# Altium schematic sheet ATmega Motherboard.SchDoc
size A4
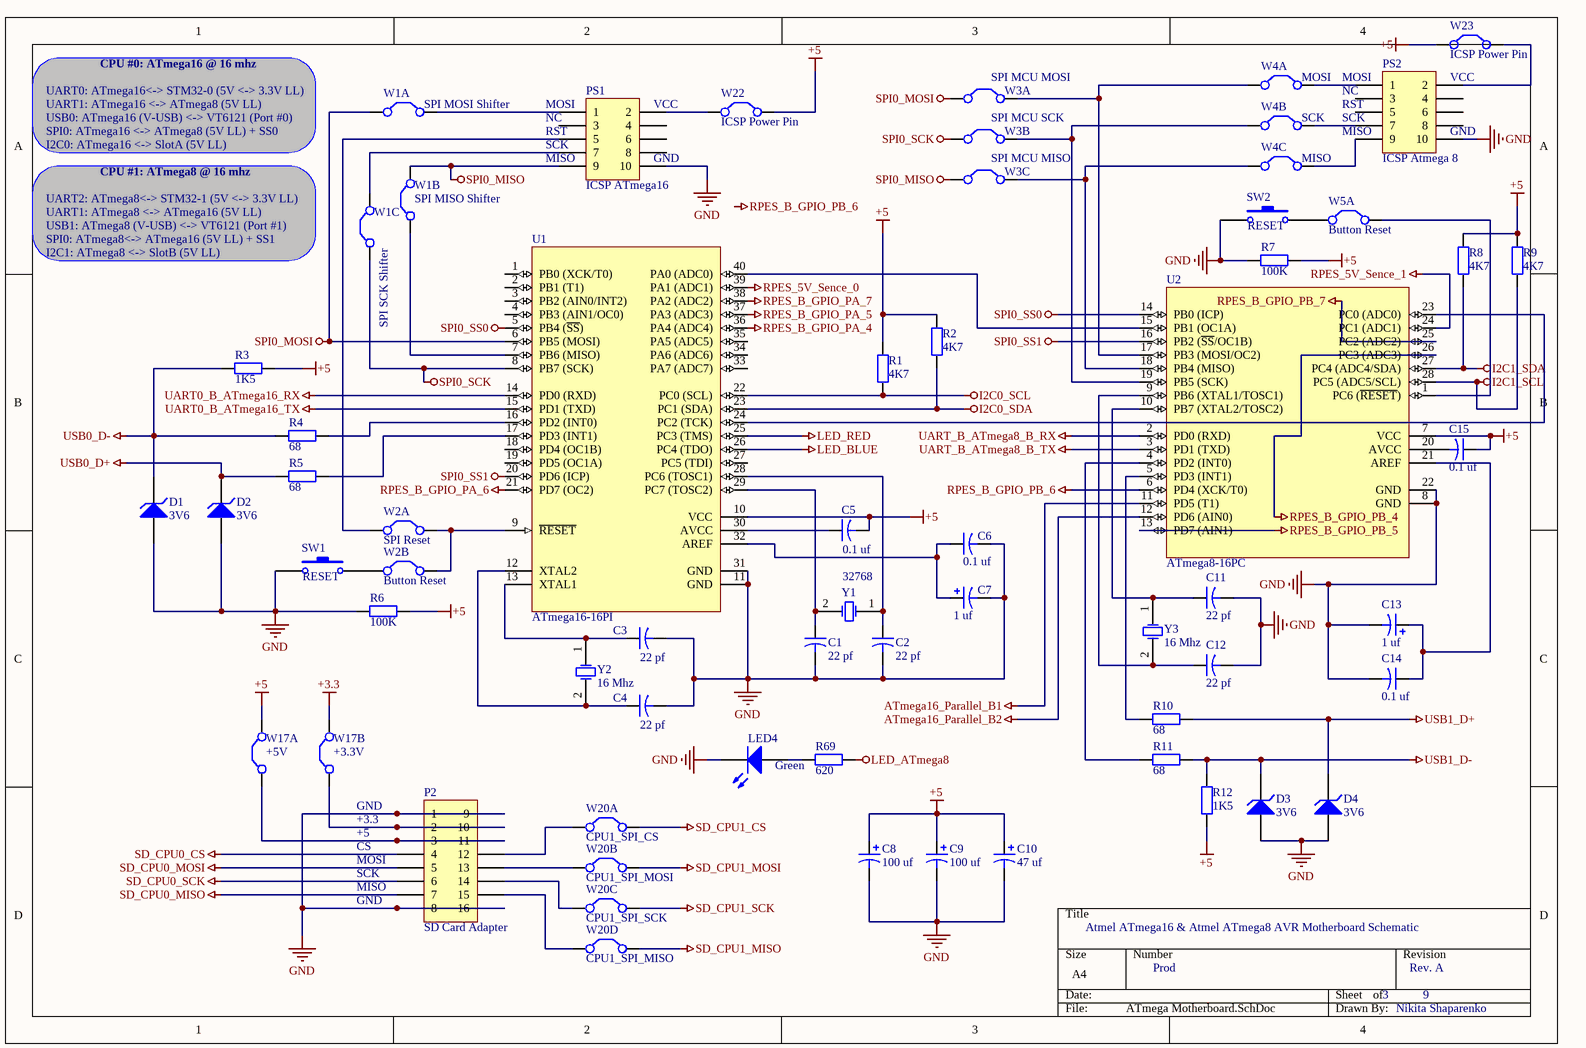
[diagram p0: ATmega Motherboard.SchDoc]

## Parts
C1  value 22 pf  [CAPR5-4X5]  (hidden comment: Cap2)
C2  value 22 pf  [CAPR5-4X5]  (hidden comment: Cap2)
C3  value 22 pf  [CAPR5-4X5]  (hidden comment: Cap2)
C4  value 22 pf  [CAPR5-4X5]  (hidden comment: Cap2)
C5  value 0.1 uf  [CAPR5-4X5]  (hidden comment: Cap2)
C6  value 0.1 uf  [CAPR5-4X5]  (hidden comment: Cap2)
C7  value 1 uf  [RAD-0.2]  (hidden comment: Cap Pol1)
C8  value 100 uf  [RAD-0.2]  (hidden comment: Cap Pol1)
C9  value 100 uf  [RAD-0.2]  (hidden comment: Cap Pol1)
C10  value 47 uf  [RAD-0.2]  (hidden comment: Cap Pol1)
C11  value 22 pf  [CAPR5-4X5]  (hidden comment: Cap2)
C12  value 22 pf  [CAPR5-4X5]  (hidden comment: Cap2)
C13  value 1 uf  [RAD-0.2]  (hidden comment: Cap Pol1)
C14  value 0.1 uf  [CAPR5-4X5]  (hidden comment: Cap2)
C15  value 0.1 uf  [CAPR5-4X5]  (hidden comment: Cap2)
D1  3V6  [DIODE-0.7]
D2  3V6  [DIODE-0.7]
D3  3V6  [DIODE-0.7]
D4  3V6  [DIODE-0.7]
LED4  Green  [LED-1]
P2  SD Card Adapter  [HDR2X8_CEN]
PS1  ICSP ATmega16  [HDR2X5]
PS2  ICSP Atmega 8  [HDR2X5]
R1  value 4K7  [AXIAL-0.4]  (hidden comment: Res2)
R2  value 4K7  [AXIAL-0.4]  (hidden comment: Res2)
R3  value 1K5  [AXIAL-0.4]  (hidden comment: Res2)
R4  value 68  [AXIAL-0.4]  (hidden comment: Res2)
R5  value 68  [AXIAL-0.4]  (hidden comment: Res2)
R6  value 100K  [AXIAL-0.4]  (hidden comment: Res2)
R7  value 100K  [AXIAL-0.4]  (hidden comment: Res2)
R8  value 4K7  [AXIAL-0.4]  (hidden comment: Res2)
R9  value 4K7  [AXIAL-0.4]  (hidden comment: Res2)
R10  value 68  [AXIAL-0.4]  (hidden comment: Res2)
R11  value 68  [AXIAL-0.4]  (hidden comment: Res2)
R12  value 1K5  [AXIAL-0.4]  (hidden comment: Res2)
R69  value 620  [AXIAL-0.4]  (hidden comment: Res2)
SW1  RESET  [SPST-2]
SW2  RESET  [SPST-2]
U1  ATmega16-16PI  [40P6]
U2  ATmega8-16PC  [28P3]
W1A  SPI MOSI Shifter  [RAD-0.1]
W1B  SPI MISO Shifter  [RAD-0.1]
W1C  SPI SCK Shifter  [RAD-0.1]
W2A  SPI Reset  [RAD-0.1]
W2B  Button Reset  [RAD-0.1]
W3A  SPI MCU MOSI  [RAD-0.1]
W3B  SPI MCU SCK  [RAD-0.1]
W3C  SPI MCU MISO  [RAD-0.1]
W4A  MOSI  [RAD-0.1]
W4B  SCK  [RAD-0.1]
W4C  MISO  [RAD-0.2]
W5A  Button Reset  [RAD-0.1]
W17A  +5V  [RAD-0.1]
W17B  +3.3V  [RAD-0.1]
W20A  CPU1_SPI_CS  [RAD-0.1]
W20B  CPU1_SPI_MOSI  [RAD-0.1]
W20C  CPU1_SPI_SCK  [RAD-0.1]
W20D  CPU1_SPI_MISO  [RAD-0.1]
W22  ICSP Power Pin  [RAD-0.1]
W23  ICSP Power Pin  [RAD-0.1]
Y1  32768  [R38]
Y2  16 Mhz  [R38]
Y3  16 Mhz  [R38]

## Nets
+3.3: W17B.2(C2)
+5: C5.2 C8.1 C9.1 C10.1 C15.1 R1.1 R2.1 R3.1 R6.1 R7.1 R8.1 R9.1 R12.2 U1.10(VCC) U2.7(VCC) W17A.2(C2) W22.2(C2) W23.1(C1)
ATmega16_Parallel_B1: U2.11(PD5_(T1))
ATmega16_Parallel_B2: U2.12(PD6_(AIN0))
GND: C1.2 C2.2 C3.2 C4.2 C6.2 C7.2 C8.2 C9.2 C10.2 C11.2 C12.2 C13.2 C14.2 D1.1(A) D2.1(A) D3.1(A) D4.1(A) LED4.2(K) P2.1 P2.8 P2.9 P2.16 PS1.10 PS2.10 R6.2 R7.2 SW1.1 SW2.1 U1.11(GND) U1.31(GND) U2.8(GND) U2.22(GND)
I2C0_SCL: R1.2 U1.22(PC0_(SCL))
I2C0_SDA: R2.2 U1.23(PC1_(SDA))
I2C1_SCL: R9.2 U2.28(PC5_(ADC5/SCL))
I2C1_SDA: R8.2 U2.27(PC4_(ADC4/SDA))
LED_ATmega8: R69.2
LED_BLUE: U1.26(PC4_(TDO))
LED_RED: U1.25(PC3_(TMS))
RPES_5V_Sence_0: U1.39(PA1_(ADC1))
RPES_5V_Sence_1: U2.24(PC1_(ADC1))
RPES_B_GPIO_PA_4: U1.36(PA4_(ADC4))
RPES_B_GPIO_PA_5: U1.37(PA3_(ADC3))
RPES_B_GPIO_PA_6: U1.21(PD7_(OC2))
RPES_B_GPIO_PA_7: U1.38(PA2_(ADC2))
RPES_B_GPIO_PB_4: U2.26(PC3_(ADC3))
RPES_B_GPIO_PB_5: U2.13(PD7_(AIN1))
RPES_B_GPIO_PB_6: U2.6(PD4_(XCK/T0))
RPES_B_GPIO_PB_7: U2.25(PC2_(ADC2))
SD_CPU0_CS: P2.4
SD_CPU0_MISO: P2.7
SD_CPU0_MOSI: P2.5
SD_CPU0_SCK: P2.6
SD_CPU1_CS: W20A.2(C2)
SD_CPU1_MISO: W20D.2(C2)
SD_CPU1_MOSI: W20B.2(C2)
SD_CPU1_SCK: W20C.2(C2)
SPI0_MISO: PS1.9 W1B.2(C2) W3C.1(C1)
SPI0_MOSI: U1.6(PB5_(MOSI)) W1A.1(C1) W3A.1(C1)
SPI0_SCK: U1.8(PB7_(SCK)) W1C.1(C1) W3B.1(C1)
SPI0_SS0: U1.5(PB4_(~{SS})) U2.14(PB0_(ICP))
SPI0_SS1: U1.20(PD6_(ICP)) U2.16(PB2_(~{SS}/OC1B))
UART0_B_ATmega16_RX: U1.14(PD0_(RXD))
UART0_B_ATmega16_TX: U1.15(PD1_(TXD))
UART_B_ATmega8_B_RX: U2.2(PD0_(RXD))
UART_B_ATmega8_B_TX: U2.3(PD1_(TXD))
USB0_D+: D2.2(K) R5.2
USB0_D-: D1.2(K) R3.2 R4.2
USB1_D+: D4.2(K) R10.2
USB1_D-: D3.2(K) R11.2 R12.1
NetC1_1: C1.1 U1.29(PC7_(TOSC2)) Y1.2(OSC2)
NetC2_1: C2.1 U1.28(PC6_(TOSC1)) Y1.1(OSC1)
NetC3_1: C3.1 U1.13(XTAL1) Y2.1(OSC1)
NetC4_1: C4.1 U1.12(XTAL2) Y2.2(OSC2)
NetC5_1: C5.1 U1.30(AVCC)
NetC6_1: C6.1 C7.1 U1.32(AREF)
NetC11_1: C11.1 U2.10(PB7_(XTAL2/TOSC2)) Y3.1(OSC1)
NetC12_1: C12.1 U2.9(PB6_(XTAL1/TOSC1)) Y3.2(OSC2)
NetC13_1: C13.1 C14.1 U2.21(AREF)
NetC15_2: C15.2 U2.20(AVCC)
NetLED4_1: LED4.1(A) R69.1
NetP2_2: P2.2 P2.10 W17B.1(C1)
NetP2_3: P2.3 P2.11 W17A.1(C1)
NetP2_12: P2.12 W20A.1(C1)
NetP2_13: P2.13 W20B.1(C1)
NetP2_14: P2.14 W20C.1(C1)
NetP2_15: P2.15 W20D.1(C1)
NetPS1_1: PS1.1 W1A.2(C2)
NetPS1_2: PS1.2 W22.1(C1)
NetPS1_5: PS1.5 W2A.1(C1)
NetPS1_7: PS1.7 W1C.2(C2)
NetPS2_1: PS2.1 W4A.2(C2)
NetPS2_2: PS2.2 W23.2(C2)
NetPS2_7: PS2.7 W4B.2(C2)
NetPS2_9: PS2.9 W4C.2(C2)
NetR4_1: R4.1 U1.16(PD2_(INT0))
NetR5_1: R5.1 U1.17(PD3_(INT1))
NetR10_1: R10.1 U2.5(PD3_(INT1))
NetR11_1: R11.1 U2.4(PD2_(INT0))
NetSW1_2: SW1.2 W2B.1(C1)
NetSW2_2: SW2.2 W5A.1(C1)
NetU1_7: U1.7(PB6_(MISO)) W1B.1(C1)
NetU1_9: U1.9(~{RESET}) W2A.2(C2) W2B.2(C2)
NetU1_24: U1.24(PC2_(TCK)) U2.23(PC0_(ADC0))
NetU1_40: U1.40(PA0_(ADC0)) U2.15(PB1_(OC1A))
NetU2_1: U2.1(PC6_(~{RESET})) W5A.2(C2)
NetU2_17: U2.17(PB3_(MOSI/OC2)) W3A.2(C2) W4A.1(C1)
NetU2_18: U2.18(PB4_(MISO)) W3C.2(C2) W4C.1(C1)
NetU2_19: U2.19(PB5_(SCK)) W3B.2(C2) W4B.1(C1)

Not connected (* = marked no-connect by the designer): PS1 3 4 6 8; PS2 3 4 5 6 8; U1 1(PB0_(XCK/T0)) 2(PB1_(T1)) 3(PB2_(AIN0/INT2)) 4(PB3_(AIN1/OC0)) 18(PD4_(OC1B)) 19(PD5_(OC1A)) 27(PC5_(TDI)) 33(PA7_(ADC7)) 34(PA6_(ADC6)) 35(PA5_(ADC5))

## Notes on the sheet
- UART0: ATmega16<-> STM32-0 (5V <-> 3.3V LL)
- USB0: ATmega16 (V-USB) <-> VT6121 (Port #0)
- UART1: ATmega16 <-> ATmega8 (5V LL)
- CPU #0: ATmega16 @ 16 mhz
- (near PS1) MOSI
- (near PS1) NC
- (near PS1) VCC
- (near PS2) MOSI
- NC
- (near PS2) RST
- (near PS2) SCK
- (near PS2) VCC
- SPI0: ATmega16 <-> ATmega8 (5V LL) + SS0
- I2C0: ATmega16 <-> SlotA (5V LL)
- CPU #1: ATmega8 @ 16 mhz
- (near PS1) RST
- (near PS1) SCK
- (near PS1) MISO
- (near PS1) GND
- (near PS2) MISO
- (near PS2) GND
- USB1: ATmega8 (V-USB) <-> VT6121 (Port #1)
- SPI0: ATmega8<-> ATmega16 (5V LL) + SS1
- I2C1: ATmega8 <-> SlotB (5V LL)
- UART1: ATmega8 <-> ATmega16 (5V LL)
- UART2: ATmega8<-> STM32-1 (5V <-> 3.3V LL)
- GND
- +3.3
- +5
- CS
- (near P2) MOSI
- (near P2) GND
- (near P2) SCK
- (near P2) MISO
- Atmel ATmega16 & Atmel ATmega8 AVR Motherboard Schematic
- Prod
- 3
- Rev. A
- 9
- Nikita Shaparenko
- Labels drawn without touching a wire or pin: RPES_B_GPIO_PB_6

## Library data of the parts
C1-C6 C11 C12 C14 C15 = Cap2: Capacitor; Published: 23-Sep-2002; PackageReference: CAPR5-4X5; Publisher: Altium Limited; PackageDescription: Capacitor; 2 Leads
C7-C10 C13 = Cap Pol1: Polarized Capacitor (Radial); Published: 8-Jun-2000; LatestRevisionDate: 17-Jul-2002; LatestRevisionNote: Re-released for DXP Platform.; PackageReference: RB7.6-15; Publisher: Altium Limited; PackageDescription: Polarized Capacitor (Radial); 2 Leads
D1-D4 = D Zener: Zener Diode; Published: 8-Jun-2000; LatestRevisionDate: 17-Jul-2002; LatestRevisionNote: Re-released for DXP Platform.; PackageReference: DIODE-0.7; Publisher: Altium Limited; PackageDescription: Diode, Thru-Hole; 2 Leads; 0.7 in Pin Spacing
LED4 = LED1: Typical RED GaAs LED; Published: 8-Jun-2000; LatestRevisionDate: 08-Jul-2005; LatestRevisionNote: Mech Layer 1 removed.; PackageReference: LED-1; Publisher: Altium Limited; PackageDescription: LED; 2 Leads
P2 = Header 8X2A: Header, 8-Pin, Dual row; LatestRevisionDate: 17-Jul-2002; LatestRevisionNote: Re-released for DXP Platform.; Publisher: Altium Limited
PS1 PS2 = Header 5X2: Header, 5-Pin, Dual row; LatestRevisionDate: 17-Jul-2002; LatestRevisionNote: Re-released for DXP Platform.; Publisher: Altium Limited
R1-R12 R69 = Res2: Resistor; Published: 8-Jun-2000; LatestRevisionDate: 17-Jul-2002; LatestRevisionNote: Re-released for DXP Platform.; PackageReference: AXIAL-0.4; Publisher: Altium Limited; PackageDescription: Axial Device, Thru-Hole; 2 Leads; 0.4 in Pin Spacing
SW1 SW2 = SW-PB: Switch; Published: 24-Mar-1999; LatestRevisionDate: 17-Jul-2002; LatestRevisionNote: Re-released for DXP Platform.; PackageReference: SPST-2; Publisher: Altium Limited; PackageDescription: Switch; 2 Leads
U1 = ATmega16-16PI: 8-Bit AVR Microcontroller with 16K Bytes of In-System Programmable Flash Memory; Published: 17-Sep-2003; DatasheetVersion: 2466E-AVR-10/02; PackageVersion: revB, Sep-2001; PackageReference: 40P6; Publisher: Altium Limited; PackageDescription: 40-lead (0.600"/15.24mm Wide) Plastic Dual Inline Package (PDIP); Supplier 1: Digi-Key; Supplier Part Number 1: ATMEGA16-16PI-ND; Supplier 2: Mouser; Supplier Part Number 2: 556-ATMEGA16-16PI; Code_JEDEC: MS-011-AC; ComponentLink1Description: Datasheet; ComponentLink1URL: http://www.atmel.com/dyn/resources/prod_documents/doc2466.pdf; ComponentLink2Description: Atmel.com Home; ComponentLink2URL: http://www.atmel.com
U2 = ATmega8-16PC: 8-Bit AVR Microcontroller with 8K Bytes of In-System Programmable Flash Memory; Published: 17-Sep-2003; DatasheetVersion: 2486H-AVR-09/02; PackageVersion: revB, Sep-2001; PackageReference: 28P3; Publisher: Altium Limited; PackageDescription: 28-lead (0.300"/7.62mm Wide) Plastic Dual Inline Package (PDIP); Supplier 1: Digi-Key; Supplier Part Number 1: ATMEGA8-16PC-ND; Supplier 2: Mouser; Supplier Part Number 2: 556-ATMEGA8-16PC; ComponentLink1Description: Datasheet; ComponentLink1URL: http://www.atmel.com/dyn/resources/prod_documents/doc2486.pdf; ComponentLink2Description: Atmel.com Home; ComponentLink2URL: http://www.atmel.com
W1A W1B W1C W2A W2B W3A W3B W3C W4A W4B W4C W5A W17A W17B W20A W20B W20C W20D W22 W23 = Jumper: Jumper Wire; Published: 24-Mar-1999; LatestRevisionDate: 17-Jul-2002; LatestRevisionNote: Re-released for DXP Platform.; PackageReference: RAD-0.2; Publisher: Altium Limited; PackageDescription: Radial Cap, Thru-Hole; 2 Leads; 0.2 in Pin Spacing
Y1-Y3 = XTAL: Crystal Oscillator; Published: 8-Jun-2000; LatestRevisionDate: 17-Jul-2002; LatestRevisionNote: Re-released for DXP Platform.; PackageReference: R38; Publisher: Altium Limited; PackageDescription: Crystal, Thru-Hole; 2 Leads; Body 3.1 x 8.2 mm (Dia.xH)